# EAGLE design test2 (EAGLE 6.6.0)
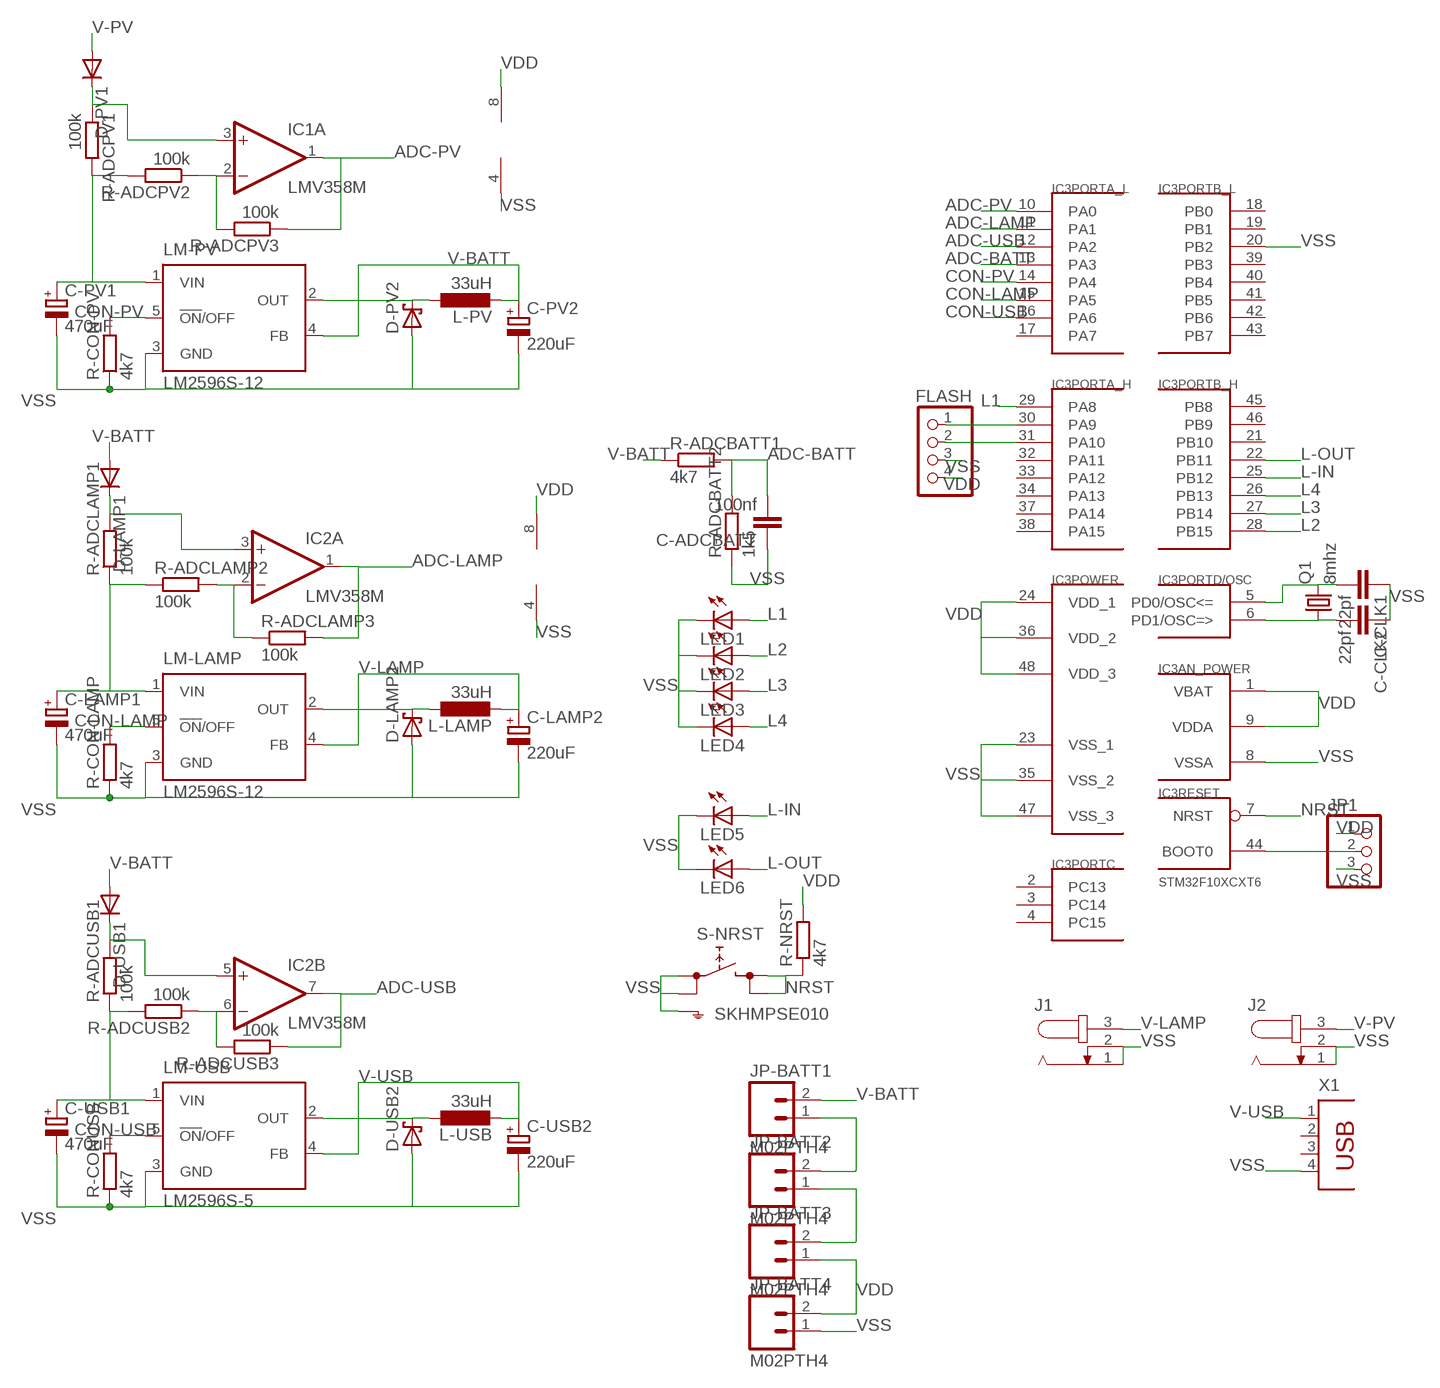
[diagram p0: schematic, sheet 1]

## Parts
C-ADCBATT  100nf  C-EUC0805  [C0805]
C-CLK1  22pf  C-EUC0805  [C0805]
C-CLK2  22pf  C-EUC0805  [C0805]
C-LAMP1  470uF  CPOL-EUE2.5-5  [E2,5-5]
C-LAMP2  220uF  CPOL-EUE2.5-5  [E2,5-5]
C-PV1  470uF  CPOL-EUE2.5-5  [E2,5-5]
C-PV2  220uF  CPOL-EUE2.5-5  [E2,5-5]
C-USB1  470uF  CPOL-EUE2.5-5  [E2,5-5]
C-USB2  220uF  CPOL-EUE2.5-5  [E2,5-5]
D-LAMP1  DIODE-DO-214AC  [DO-214AC]
D-LAMP2  SCHOTTKY-DIODE  [DIODE_SMB]
D-PV1  DIODE-DO-214AC  [DO-214AC]
D-PV2  SCHOTTKY-DIODE  [DIODE_SMB]
D-USB1  DIODE-DO-214AC  [DO-214AC]
D-USB2  SCHOTTKY-DIODE  [DIODE_SMB]
FLASH  PINHD-1X4  [1X04]
IC1  LMV358M  [SO08]
IC2  LMV358M  [SO08]
IC3  STM32F10XCXT6  [TQFP48]
J1  JACK-PLUG0  [SPC4077]
J2  JACK-PLUG0  [SPC4077]
JP1  PINHD-1X3  [1X03]
JP-BATT1  M02PTH4  [1X02_XTRA_BIG]
JP-BATT2  M02PTH4  [1X02_XTRA_BIG]
JP-BATT3  M02PTH4  [1X02_XTRA_BIG]
JP-BATT4  M02PTH4  [1X02_XTRA_BIG]
L-LAMP  33uH  L-EUWE-TPC  [POWER-CHOKE_WE-TPC]
L-PV  33uH  L-EUWE-TPC  [POWER-CHOKE_WE-TPC]
L-USB  33uH  L-EUWE-TPC  [POWER-CHOKE_WE-TPC]
LED1  LEDCHIP-LED0805  [CHIP-LED0805]
LED2  LEDCHIP-LED0805  [CHIP-LED0805]
LED3  LEDCHIP-LED0805  [CHIP-LED0805]
LED4  LEDCHIP-LED0805  [CHIP-LED0805]
LED5  LEDCHIP-LED0805  [CHIP-LED0805]
LED6  LEDCHIP-LED0805  [CHIP-LED0805]
LM-LAMP  LM2596S-12  LM2596S  [TO263-5]
LM-PV  LM2596S-12  LM2596S  [TO263-5]
LM-USB  LM2596S-5  LM2596S  [TO263-5]
Q1  8mhz  CRYSTALHC49S  [HC49/S]
R-ADCBATT1  4k7  R-EU_R0805  [R0805]
R-ADCBATT2  1k5  R-EU_R0805  [R0805]
R-ADCLAMP1  100k  R-EU_R0805  [R0805]
R-ADCLAMP2  100k  R-EU_R0805  [R0805]
R-ADCLAMP3  100k  R-EU_R0805  [R0805]
R-ADCPV1  100k  R-EU_R0805  [R0805]
R-ADCPV2  100k  R-EU_R0805  [R0805]
R-ADCPV3  100k  R-EU_R0805  [R0805]
R-ADCUSB1  100k  R-EU_R0805  [R0805]
R-ADCUSB2  100k  R-EU_R0805  [R0805]
R-ADCUSB3  100k  R-EU_R0805  [R0805]
R-CON-LAMP  4k7  R-EU_R0805  [R0805]
R-CON-PV  4k7  R-EU_R0805  [R0805]
R-CONUSB  4k7  R-EU_R0805  [R0805]
R-NRST  4k7  R-EU_R0805  [R0805]
S-NRST  SKHMPSE010  [SKHMPXE010]
X1  PN87520  [PN87520]

## Nets
ADC-BATT: C-ADCBATT.2 IC3.13(PORTA_L:PA3) R-ADCBATT1.2 R-ADCBATT2.2
ADC-LAMP: IC2.1(A:OUT) IC3.11(PORTA_L:PA1) R-ADCLAMP3.2
ADC-PV: IC1.1(A:OUT) IC3.10(PORTA_L:PA0) R-ADCPV3.1
ADC-USB: IC2.7(B:OUT) IC3.12(PORTA_L:PA2) R-ADCUSB3.1
CON-LAMP: IC3.15(PORTA_L:PA5) LM-LAMP.5(!ON!/OFF) R-CON-LAMP.2
CON-PV: IC3.14(PORTA_L:PA4) LM-PV.5(!ON!/OFF) R-CON-PV.2
CON-USB: IC3.16(PORTA_L:PA6) LM-USB.5(!ON!/OFF) R-CONUSB.2
L1: IC3.29(PORTA_H:PA8) LED1.A
L2: IC3.28(PORTB_H:PB15) LED2.A
L3: IC3.27(PORTB_H:PB14) LED3.A
L4: IC3.26(PORTB_H:PB13) LED4.A
L-IN: IC3.25(PORTB_H:PB12) LED5.A
L-OUT: IC3.22(PORTB_H:PB11) LED6.A
N$1: D-PV2.C(A) L-PV.1 LM-PV.2(OUT)
N$2: D-LAMP2.C(A) L-LAMP.1 LM-LAMP.2(OUT)
N$3: D-USB2.C(A) L-USB.1 LM-USB.2(OUT)
N$4: IC2.2(A:-IN) R-ADCLAMP2.2 R-ADCLAMP3.1
N$5: C-USB1.+ LM-USB.1(VIN) R-ADCUSB1.1 R-ADCUSB2.2
N$6: C-CLK2.2 IC3.6(PORTD/OSC:PD1/OSC=>) Q1.1
N$7: C-LAMP1.+ LM-LAMP.1(VIN) R-ADCLAMP1.1 R-ADCLAMP2.1
N$8: D-LAMP1.C IC2.3(A:+IN) R-ADCLAMP1.2
N$9: IC1.2(A:-IN) R-ADCPV2.1 R-ADCPV3.2
N$10: C-PV1.+ LM-PV.1(VIN) R-ADCPV1.2 R-ADCPV2.2
N$11: D-PV1.C IC1.3(A:+IN) R-ADCPV1.1
N$12: IC3.44(RESET:BOOT0) JP1.2
N$13: C-CLK1.2 IC3.5(PORTD/OSC:PD0/OSC<=) Q1.2
N$14: IC2.6(B:-IN) R-ADCUSB2.1 R-ADCUSB3.2
N$15: D-USB1.C IC2.5(B:+IN) R-ADCUSB1.2
N$16: FLASH.2 IC3.31(PORTA_H:PA10)
N$17: FLASH.1 IC3.30(PORTA_H:PA9)
N$20: JP-BATT2.1 JP-BATT3.2
N$21: JP-BATT1.1 JP-BATT2.2
NRST: IC3.7(RESET:NRST) R-NRST.1 S-NRST.3(2.1) S-NRST.4(2.2)
V-BATT: C-PV2.+ D-LAMP1.A D-USB1.A JP-BATT1.2 L-PV.2 LM-PV.4(FB) R-ADCBATT1.1
V-LAMP: C-LAMP2.+ J1.3 L-LAMP.2 LM-LAMP.4(FB)
V-PV: D-PV1.A J2.3
V-USB: C-USB2.+ L-USB.2 LM-USB.4(FB) X1.1
VDD: FLASH.4 IC1.8(P:V+) IC2.8(P:V+) IC3.1(AN_POWER:VBAT) IC3.9(AN_POWER:VDDA) IC3.24(POWER:VDD_1) IC3.36(POWER:VDD_2) IC3.48(POWER:VDD_3) JP1.1 JP-BATT3.1 JP-BATT4.2 R-NRST.2
VSS: C-ADCBATT.1 C-CLK1.1 C-CLK2.1 C-LAMP1.- C-LAMP2.- C-PV1.- C-PV2.- C-USB1.- C-USB2.- D-LAMP2.A(C) D-PV2.A(C) D-USB2.A(C) FLASH.3 IC1.4(P:V-) IC2.4(P:V-) IC3.8(AN_POWER:VSSA) IC3.20(PORTB_L:PB2) IC3.23(POWER:VSS_1) IC3.35(POWER:VSS_2) IC3.47(POWER:VSS_3) J1.1 J1.2 J2.1 J2.2 JP1.3 JP-BATT4.1 LED1.C LED2.C LED3.C LED4.C LED5.C LED6.C LM-LAMP.3(GND) LM-PV.3(GND) LM-USB.3(GND) R-ADCBATT2.1 R-CON-LAMP.1 R-CON-PV.1 R-CONUSB.1 S-NRST.1(1.1) S-NRST.2(1.2) S-NRST.5(SH) X1.4
Unconnected: IC1.5(B:+IN) IC1.6(B:-IN) IC1.7(B:OUT) IC3.2(PORTC:PC13) IC3.3(PORTC:PC14) IC3.4(PORTC:PC15) IC3.17(PORTA_L:PA7) IC3.18(PORTB_L:PB0) IC3.19(PORTB_L:PB1) IC3.21(PORTB_H:PB10) IC3.32(PORTA_H:PA11) IC3.33(PORTA_H:PA12) IC3.34(PORTA_H:PA13) IC3.37(PORTA_H:PA14) IC3.38(PORTA_H:PA15) IC3.39(PORTB_L:PB3) IC3.40(PORTB_L:PB4) IC3.41(PORTB_L:PB5) IC3.42(PORTB_L:PB6) IC3.43(PORTB_L:PB7) IC3.45(PORTB_H:PB8) IC3.46(PORTB_H:PB9) X1.2 X1.3

## Library data of the parts
C-ADCBATT C-CLK1 C-CLK2 = resistor:C-EU: CAPACITOR, European symbol
C-LAMP1 C-LAMP2 C-PV1 C-PV2 C-USB1 C-USB2 = resistor:CPOL-EU: POLARIZED CAPACITOR, European symbol
D-LAMP1 D-PV1 D-USB1 = diode:DIODE-: DIODE
D-LAMP2 D-PV2 D-USB2 = eagle-ltspice:SCHOTTKY-DIODE: Schottky Diode; SPICEMODEL: NONE; SPICEPREFIX: D; SPICETYPE: diode
FLASH = pinhead:PINHD-1X4: PIN HEADER
IC1 IC2 = linear:LMV358?*: Dual General Purpose, Low Voltage, Rail-to-Rail Output Operational Amplifiers Source: http://www.national.com/mpf/LM/LMV321.html http://www.national.com/dt/lmv_qual.pdf
IC3 = stm32:STM32F10XCXT6: ST STM32F101/103 48pin LQFP
J1 J2 = con-jack:JACK-PLUG: DC POWER JACK Power Jack, DC, Right Angle, Through Hole, Rated 5A at 16VDC, PC Terminals Distributor: Farnell (www.Farnell.de) Drawing: 84N1161.pdf / 84N1162.pdf Manufacturer: SPC Technology (www.spctechnology.com) Type: SPC4077 / SPC 4078; OC_FARNELL: unknown; OC_NEWARK: unknown
JP1 = pinhead:PINHD-1X3: PIN HEADER
JP-BATT1-JP-BATT4 = SparkFun-Connectors:M02: Standard 2-pin 0.1" header. Use with - straight break away headers ( PRT-00116) - right angle break away headers (PRT-00553) - swiss pins (PRT-00743) - machine pins (PRT-00117) - female headers (PRT-00115) Molex polarized connector foot print use with: PRT-08233 with associated crimp pins and housings. 2.54_SCREWTERM for use with PRT-10571. 3.5mm Screw Terminal footprints for PRT-08084 5mm Screw Terminal footprints for use with PRT-08432
L-LAMP L-PV L-USB = resistor:L-EU: INDUCTOR, European symbol
LED1-LED6 = led:LED: LED OSRAM: - CHIPLED LG R971, LG N971, LY N971, LG Q971, LY Q971, LO R971, LY R971 LH N974, LH R974 LS Q976, LO Q976, LY Q976 LO Q996 - Hyper CHIPLED LW Q18S LB Q993, LB Q99A, LB R99A - SideLED LS A670, LO A670, LY A670, LG A670, LP A670 LB A673, LV A673, LT A673, LW A673 LH A674 LY A675 LS A676, LA A676, LO A676, LY A676, LW A676 LS A679, LY A679, LG A679 - Hyper Micro SIDELED® LS Y876, LA Y876, LO Y876, LY Y876 LT Y87S - SmartLED LW L88C, LW L88S LB L89C, LB L89S, LG L890 LS L89K, LO L89K, LY L89K LS L896, LA L896, LO L896, LY L896 - TOPLED LS T670, LO T670, LY T670, LG T670, LP T670 LSG T670, LSP T670, LSY T670, LOP T670, LYG T670 LG T671, LOG T671, LSG T671 LB T673, LV T673, LT T673, LW T673 LH T674 LS T676, LA T676, LO T676, LY T676, LB T676, LH T676, LSB T676, LW T676 LB T67C, LV T67C, LT T67C, LS T67K, LO T67K, LY T67K, LW E67C LS E67B, LA E67B, LO E67B, LY E67B, LB E67C, LV E67C, LT E67C LW T67C LS T679, LY T679, LG T679 LS T770, LO T770, LY T770, LG T770, LP T770 LB T773, LV T773, LT T773, LW T773 LH T774 LS E675, LA E675, LY E675, LS T675 LS T776, LA T776, LO T776, LY T776, LB T776 LHGB T686 LT T68C, LB T68C - Hyper Mini TOPLED® LB M676 - Mini TOPLED Santana® LG M470 LS M47K, LO M47K, LY M47K Source: http://www.osram.convergy.de LUXEON: - LUMILED® LXK2-PW12-R00, LXK2-PW12-S00, LXK2-PW14-U00, LXK2-PW14-V00 LXK2-PM12-R00, LXK2-PM12-S00, LXK2-PM14-U00 LXK2-PE12-Q00, LXK2-PE12-R00, LXK2-PE12-S00, LXK2-PE14-T00, LXK2-PE14-U00 LXK2-PB12-K00, LXK2-PB12-L00, LXK2-PB12-M00, LXK2-PB14-N00, LXK2-PB14-P00, LXK2-PB14-Q00 LXK2-PR12-L00, LXK2-PR12-M00, LXK2-PR14-Q00, LXK2-PR14-R00 LXK2-PD12-Q00, LXK2-PD12-R00, LXK2-PD12-S00 LXK2-PH12-R00, LXK2-PH12-S00 LXK2-PL12-P00, LXK2-PL12-Q00, LXK2-PL12-R00 Source: www.luxeon.com KINGBRIGHT: KA-3528ASYC Source: www.kingbright.com
LM-LAMP LM-PV LM-USB = national-semiconductor:LM2596: SIMPLE SWITCHER® Power Converter 150 kHz 3A Step-Down Voltage Regulator Source: http://www.national.com/ds/LM/LM2596.pdf; MF: NATIONAL SEMICONDUCTOR; MPN: LM2596S-ADJ/NOPB; OC_FARNELL: 9494367; OC_NEWARK: 41K3842
Q1 = crystal:CRYSTAL: CRYSTAL; OC_FARNELL: 1667008; OC_NEWARK: unknown
R-ADCBATT1 R-ADCBATT2 R-ADCLAMP1-R-ADCLAMP3 R-ADCPV1-R-ADCPV3 R-ADCUSB1-R-ADCUSB3 R-CON-LAMP R-CON-PV R-CONUSB R-NRST = resistor:R-EU_: RESISTOR, European symbol
S-NRST = switch:SKHMP*E010: 6.2 X 6.5mm TACT Switch (SMD) Source: http://www3.alps.co.jp/WebObjects/catalog.woa/PDF/E/Switch/Tact/SKHM/SKHM.PDF
X1 = con-berg:PN87520: BERG USB connector; OC_FARNELL: unknown; OC_NEWARK: unknown

## Board
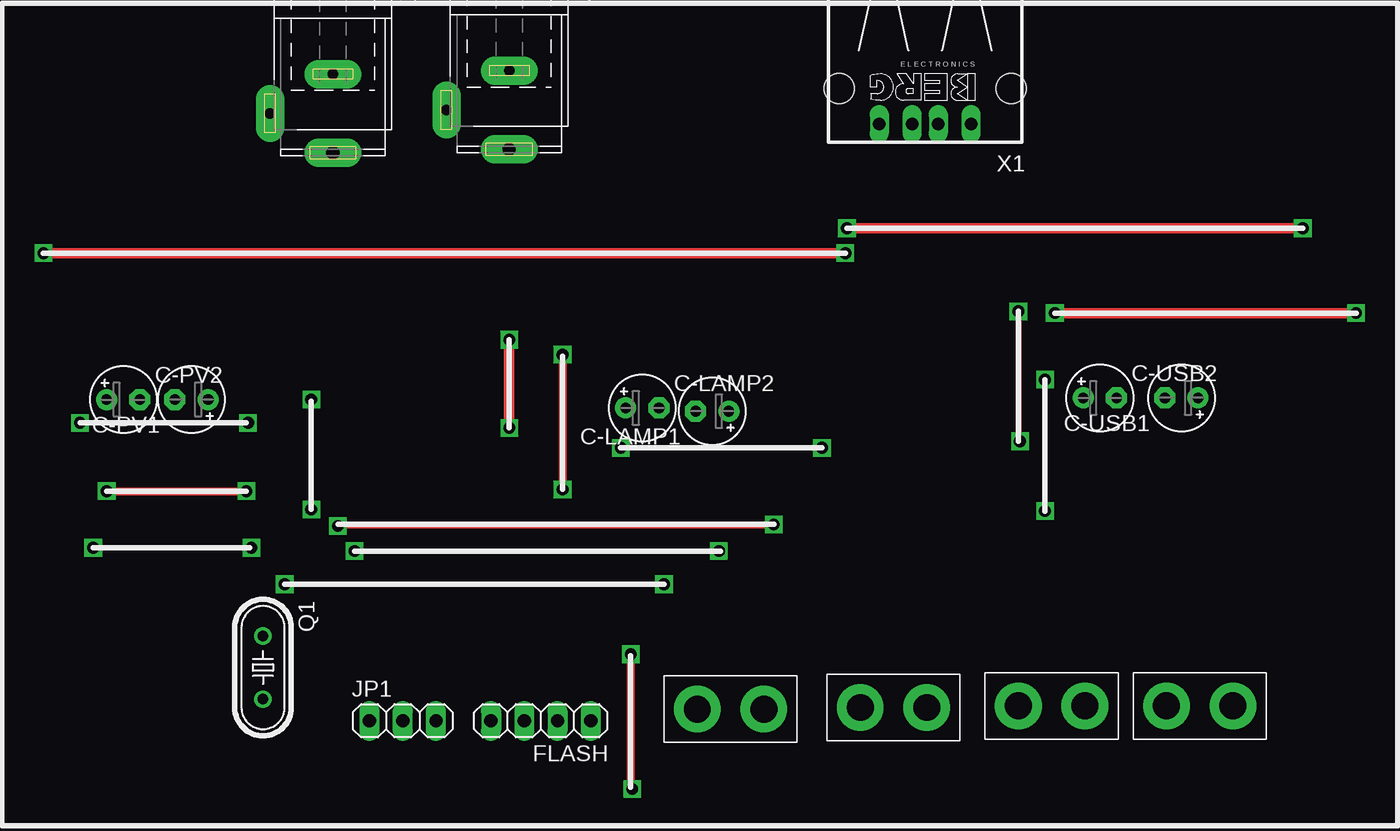
[diagram p1: board, top side]
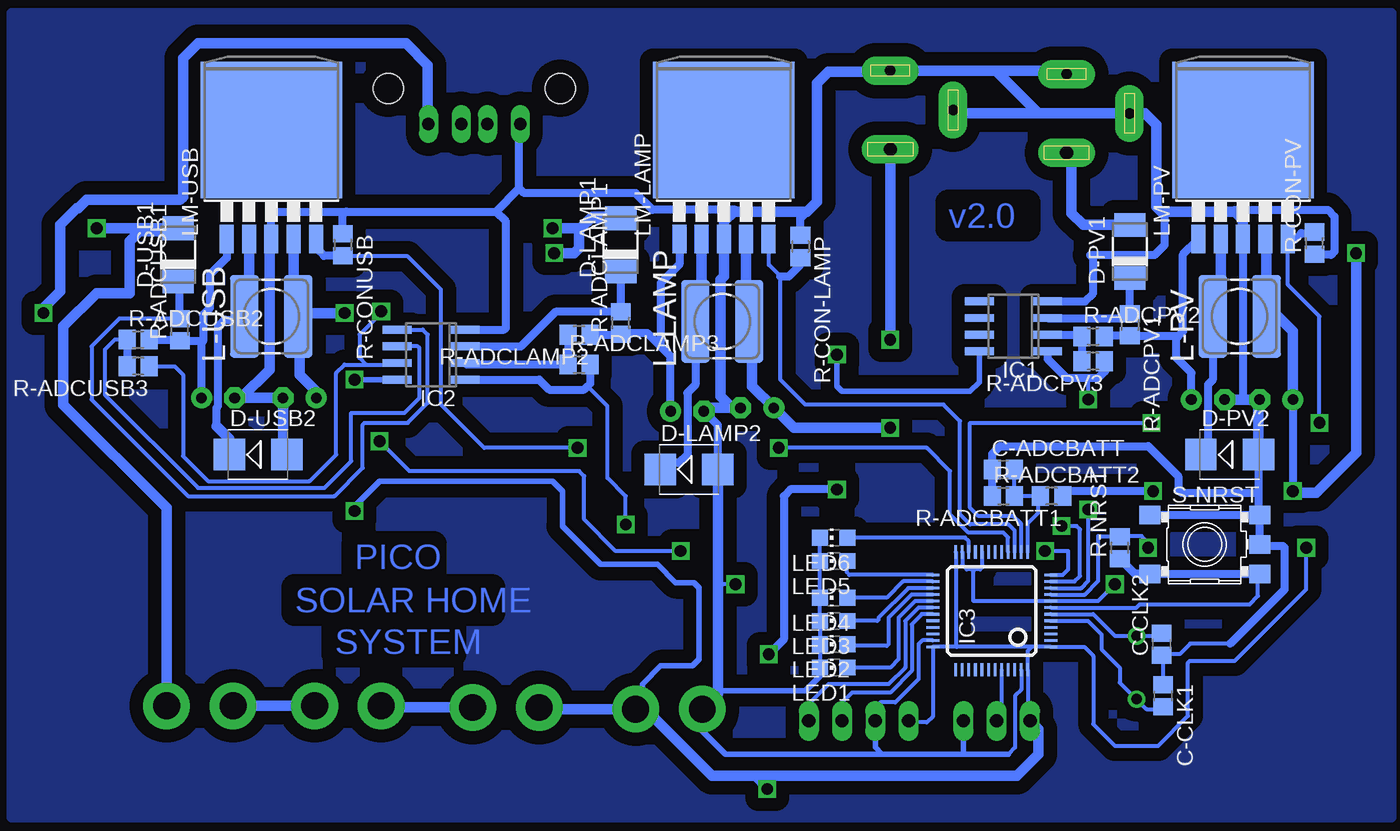
[diagram p2: board, bottom side, seen from below]

No outline drawn. Coordinates in mm, seen from the top.
Copper layers (1*16): Top 0.035mm / dielectric 1.5mm / Bottom 0.035mm
Design rules "default": minimum track width 10mil, minimum drill 24mil, track to track 8mil, track to pad 8mil, pad to pad 8mil, via to via 8mil, smd to smd 8mil, copper to edge 40mil, drill to drill 8mil, minimum pad ring 10mil, minimum via ring 8mil, stop-mask expansion 4mil, vias tented up to drill 0mil, thermal gap 10mil

### Footprints (pad centres in the part's own frame; a part is rotated, then mirrored left to right if it is on the bottom)
C0805 = smd 1.3 x 1.5: 1 -0.85,0; 2 0.85,0
E2,5-5 = drill 0.813 pad 1.6: + -1.27,0 | drill 0.813 pad 1.6 octagon: - 1.27,0
DO-214AC = smd 1.8 x 2.4: A 2.025,0; C -2.025,0
DIODE_SMB = smd 2.4 x 2.4: A 2.2,0; C -2.2,0
1X04 = drill 1.016 long: 1 -3.81,0; 2 -1.27,0; 3 1.27,0; 4 3.81,0
SO08 = smd 0.6 x 2.2: 1 -1.905,-2.6; 2 -0.635,-2.6; 3 0.635,-2.6; 4 1.905,-2.6; 5 1.905,2.6; 6 0.635,2.6; 7 -0.635,2.6; 8 -1.905,2.6
TQFP48 = smd 0.2 x 1: 1 -2.75,-4.5; 2 -2.25,-4.5; 3 -1.75,-4.5; 4 -1.25,-4.5; 5 -0.75,-4.5; 6 -0.25,-4.5; 7 0.25,-4.5; 8 0.75,-4.5; 9 1.25,-4.5; 10 1.75,-4.5; 11 2.25,-4.5; 12 2.75,-4.5; 25 2.75,4.5; 26 2.25,4.5; 27 1.75,4.5; 28 1.25,4.5; 29 0.75,4.5; 30 0.25,4.5; 31 -0.25,4.5; 32 -0.75,4.5; 33 -1.25,4.5; 34 -1.75,4.5; 35 -2.25,4.5; 36 -2.75,4.5 | smd 1 x 0.2: 13 4.5,-2.75; 14 4.5,-2.25; 15 4.5,-1.75; 16 4.5,-1.25; 17 4.5,-0.75; 18 4.5,-0.25; 19 4.5,0.25; 20 4.5,0.75; 21 4.5,1.25; 22 4.5,1.75; 23 4.5,2.25; 24 4.5,2.75; 37 -4.5,2.75; 38 -4.5,2.25; 39 -4.5,1.75; 40 -4.5,1.25; 41 -4.5,0.75; 42 -4.5,0.25; 43 -4.5,-0.25; 44 -4.5,-0.75; 45 -4.5,-1.25; 46 -4.5,-1.75; 47 -4.5,-2.25; 48 -4.5,-2.75
SPC4077 = drill 0.8 pad 2.184 long: 1 -3,0; 2 0,-4.8 | drill 1 pad 2.184 long: 3 3,0
1X03 = drill 1.016 long: 1 -2.54,0; 2 0,0; 3 2.54,0
1X02_XTRA_BIG = drill 2.057 pad 3.556: 1 -2.54,0; 2 2.54,0
POWER-CHOKE_WE-TPC = smd 6.3 x 2.2: 1 0,2.05; 2 0,-2.05
CHIP-LED0805 = smd 1.2 x 1.2: A 0,-1.05; C 0,1.05
TO263-5 = smd 1.067 x 2.159: 1 -3.404,-5.791; 2 -1.702,-5.791; 3 0,-5.791; 4 1.702,-5.791; 5 3.404,-5.791 | smd 10.8 x 10.41: 6 0,2.54
HC49/S = drill 0.813: 1 -2.413,0; 2 2.413,0
R0805 = smd 1.3 x 1.5: 1 -0.85,0; 2 0.85,0
SKHMPXE010 = smd 1.6 x 1.4: 1 -4.2,2.25; 2 4.2,2.25; 3 -4.2,-2.25; 4 4.2,-2.25; 5 4.2,0
PN87520 = drill 0.95 long: 1 -3.5,2.71; 2 -1,2.71; 3 1,2.71; 4 3.5,2.71 | hole 2.3: -6.57,0; 6.57,0

### Placement (x,y rotation side)
C-ADCBATT  26.67,29.46 0 bottom
C-CLK1  14.48,12.19 270 bottom
C-CLK2  14.61,16.13 90 bottom
C-LAMP1  50.8,33.91 180 top
C-LAMP2  45.47,34.16 0 top
C-PV1  11.05,34.8 180 top
C-PV2  5.84,34.8 0 top
C-USB1  86.61,34.92 180 top
C-USB2  80.39,34.92 0 top
D-LAMP1  55.88,46.61 90 bottom
D-LAMP2  50.67,29.46 0 bottom
D-PV1  17.02,46.1 90 bottom
D-PV2  9.4,30.61 0 bottom
D-USB1  89.66,45.85 90 bottom
D-USB2  83.57,30.61 0 bottom
FLASH  37.72,10.29 180 top
IC1  25.91,40.39 90 bottom
IC2  70.36,38.23 90 bottom
IC3  27.56,18.67 90 bottom
J1  35.31,56.9 270 top
J2  21.84,56.64 270 top
JP1  27.18,10.29 0 top
JP-BATT1  88.01,11.43 0 top
JP-BATT2  76.71,11.43 0 top
JP-BATT3  64.64,11.3 0 top
JP-BATT4  52.2,11.18 0 top
L-LAMP  48.13,40.77 90 bottom
L-PV  8.64,41.15 90 bottom
L-USB  82.55,41.15 90 bottom
LED1  39.62,14.35 90 bottom
LED2  39.62,16.13 90 bottom
LED3  39.62,17.91 90 bottom
LED4  39.62,19.68 90 bottom
LED5  39.62,22.48 90 bottom
LED6  39.62,24.26 90 bottom
LM-LAMP  48.01,52.83 0 bottom
LM-PV  8.38,52.83 0 bottom
LM-USB  82.55,52.83 0 bottom
Q1  16.51,14.35 270 top
R-ADCBATT1  22.99,27.43 180 bottom
R-ADCBATT2  26.67,27.43 0 bottom
R-ADCLAMP1  55.88,40.64 90 bottom
R-ADCLAMP2  59.05,39.75 180 bottom
R-ADCLAMP3  59.05,37.47 0 bottom
R-ADCPV1  17.02,40.51 270 bottom
R-ADCPV2  19.81,39.62 0 bottom
R-ADCPV3  19.81,37.72 180 bottom
R-ADCUSB1  89.53,40.13 90 bottom
R-ADCUSB2  92.71,39.37 0 bottom
R-ADCUSB3  92.71,37.34 180 bottom
R-CON-LAMP  42.16,46.48 270 bottom
R-CON-PV  2.92,46.74 90 bottom
R-CONUSB  77.09,46.61 270 bottom
R-NRST  17.78,23.5 90 bottom
S-NRST  11.3,23.75 0 bottom
X1  67.06,58.55 180 top

### Tracks (layer width: path | path; a pad name or v marks a point on that pad's centre or on a via)
ADC-BATT
  Bottom 0.305: IC3.13 24.81,25.36 24,26.16 24,27.27 R-ADCBATT1.2 R-ADCBATT2.2 C-ADCBATT.2
ADC-LAMP  (via drill 0.9)
  Top 0.305: v22.23,25.15 55.37,25.15 v55.5,25.27
  Bottom 0.305: IC3.11 21.25,20.92 20.83,21.34 20.83,24.89 21.08,25.15 v22.23,25.15 | v55.5,25.27 55.5,27.43 56.9,28.83 56.9,34.29 58.42,35.81
  Bottom 0.61: IC2.1 62.1,36.32 61.34,35.56 58.67,35.56 58.42,35.81 58.2,36.03 R-ADCLAMP3.2
ADC-PV  (via drill 0.9)
  Top 0.305: v20.19,26.42 v20.19,34.8
  Bottom 0.305: IC3.10 20.73,20.42 20.19,20.95 v20.19,26.42 | v20.19,34.8 20.19,36.32 20.32,36.45
  Bottom 0.61: IC1.1 23.31,37.91 21.84,36.45 20.32,36.45 19.43,36.45 18.92,36.96 18.92,37.68 R-ADCPV3.1
ADC-USB  (via drill 0.9)
  Top 0.305: v23.5,23.24 v51.31,23.24 | v74.3,31.62 74.3,41.4 v74.17,41.53
  Bottom 0.305: R-ADCUSB3.1 89.92,37.34 89.28,36.7 89.28,30.48 87.38,28.57 79.63,28.57 77.6,30.61 77.6,36.83 76.96,37.47 75.31,37.47 | 75.31,37.47 73.08,37.47 IC2.7 | IC3.12 22.14,21.42 21.72,21.84 21.72,23.24 v23.5,23.24 | v51.31,23.24 56.26,23.24 58.67,25.65 58.67,28.96 59.05,29.34 72.01,29.34 v74.3,31.62 | v74.17,41.53 74.17,41.4 75.82,39.75 75.82,37.97 75.31,37.47
CON-LAMP
  Bottom 0.305: IC3.15 25.81,24.79 26.29,25.27 29.21,25.27 29.97,26.04 29.97,33.15 31.24,34.42 41.78,34.42 43.69,36.32 43.69,44.2 44.58,45.09 44.58,47.02 LM-LAMP.5
  Bottom 0.61: 43.69,44.2 43.05,44.2 42.16,45.09 R-CON-LAMP.2
CON-PV  (via drill 0.9)
  Top 0.305: v15.37,33.02 v2.54,33.02
  Bottom 0.305: IC3.14 25.31,25.31 25.91,25.91 28.57,25.91 29.21,26.54 29.21,33.02 v15.37,33.02 | v2.54,33.02 2.54,41.15 4.95,43.56 4.95,47.02 LM-PV.5
  Bottom 0.61: 4.95,47.02 4.42,47.02 3.94,47.5 3.01,47.5 R-CON-PV.2
CON-USB  (via drill 0.9)
  Top 0.305: v43.81,31.11 v59.18,31.11
  Bottom 0.305: IC3.16 26.31,24.28 26.67,24.64 29.34,24.64 30.73,26.04 30.73,29.34 32.51,31.11 v43.81,31.11 | v59.18,31.11 66.29,31.11 69.6,34.42 69.6,43.18 72.14,45.72 77.05,45.72 R-CONUSB.2
  Bottom 0.61: R-CONUSB.2 78.53,45.76 79.12,46.35 79.12,47.02 LM-USB.5
L1
  Bottom 0.305: IC3.29 33.41,19.42 34.67,18.16 34.67,14.99 35.31,14.35 LED1.A
L2
  Bottom 0.305: IC3.28 33.67,19.92 35.43,18.16 35.43,16.13 35.56,16 38.45,16 LED2.A
L3
  Bottom 0.305: IC3.27 33.94,20.42 36.2,18.16 36.2,18.03 36.32,17.91 LED3.A
L4
  Bottom 0.305: IC3.26 34.33,20.92 35.56,19.68 LED4.A
L-IN
  Bottom 0.305: IC3.25 38.44,21.42 38.61,21.59 38.61,22.45 LED5.A
L-OUT
  Bottom 0.305: IC3.22 29.31,23.98 29.59,24.26 LED6.A
N$1
  Bottom 0.61: L-PV.1 10.69,36.3 11.05,35.94 11.05,31.16 D-PV2.C
  Bottom 0.813: LM-PV.2 10.08,41.75 L-PV.1
N$2
  Bottom 0.61: L-LAMP.1 50.18,35.92 50.8,35.31 50.8,30.61 51.44,29.97 52.37,29.97 D-LAMP2.C
  Bottom 0.813: LM-LAMP.2 49.71,41.24 L-LAMP.1
N$3
  Bottom 0.61: 86.74,32.77 86.74,34.16 86.61,34.29 86.61,40.39 86.11,40.89 85.09,40.89 84.84,40.64 | L-USB.1 84.58,41.15 84.45,41.02
  Bottom 0.813: LM-USB.2 84.25,41.22 84.45,41.02 84.84,40.64 | D-USB2.C 85.77,31.79 86.74,32.77
N$4
  Bottom 0.61: R-ADCLAMP2.2 R-ADCLAMP3.1 67.63,37.47 IC2.2
N$5
  Bottom 0.61: LM-USB.1 85.95,45.62 87.25,44.32 87.25,41.78 87.76,41.27 87.76,39.24 87.88,39.24 | 87.88,39.24 89.5,39.24 R-ADCUSB1.1 89.62,39.37 R-ADCUSB2.2 | C-USB1.+ 87.88,39.24
N$6
  Bottom 0.305: IC3.6 19.82,18.42 18.16,16.76 Q1.1 14.82,16.76 C-CLK2.2
N$7
  Bottom 0.61: C-LAMP1.+ 52.07,38.1 52.83,38.86 | 52.83,38.86 53.85,39.88 55.79,39.88 R-ADCLAMP1.1 55.92,39.75 R-ADCLAMP2.1 | LM-LAMP.1 51.41,45.11 52.83,43.69 52.83,38.86
N$8
  Bottom 0.61: D-LAMP1.C R-ADCLAMP1.2 60.87,41.49 63.5,38.86 IC2.3
N$9
  Bottom 0.61: R-ADCPV3.2 R-ADCPV2.1 20.79,39.75 IC1.2
N$10
  Bottom 0.61: 13.3,39.66 R-ADCPV1.2 18.92,39.66 R-ADCPV2.2 | 13.3,39.66 12.95,40.01 12.95,45.87 LM-PV.1 | C-PV1.+ 12.32,36.83 13.46,37.97 13.46,39.5 13.3,39.66
N$11
  Bottom 0.61: D-PV1.C R-ADCPV1.1 17.36,41.02 IC1.3
N$12
  Bottom 0.305: IC3.44 26.81,10.66 JP1.2
N$13
  Bottom 0.305: IC3.5 20.2,17.92 19.18,16.89 19.18,15.75 17.78,14.35 17.78,13.21 Q1.2 15.75,11.18 14.64,11.18 C-CLK1.2
N$14
  Bottom 0.305: R-ADCUSB2.1 94.49,39.37 95.25,38.61 95.25,35.18 88.14,28.07 78.49,28.07 76.45,30.1 76.45,33.78 72.39,33.78 71.25,34.92 71.25,38.73 71.37,38.86 IC2.6
  Bottom 0.61: R-ADCUSB2.1 R-ADCUSB3.2
N$15
  Bottom 0.305: R-ADCUSB1.2 94.15,40.98 96.27,38.86 96.27,34.8 88.9,27.43 77.72,27.43 75.56,29.59 75.56,32.89 75.44,33.02 72.14,33.02 70.61,34.54 70.61,39.75 70.99,40.13 IC2.5
  Bottom 0.61: R-ADCUSB1.2 89.53,43.7 D-USB1.C
N$16
  Bottom 0.305: IC3.31 32.89,18.42 33.66,17.65 33.66,14.1 35.31,12.45 38.23,12.45 38.99,11.68 FLASH.2
N$17
  Bottom 0.305: IC3.30 33.15,18.92 34.16,17.91 34.16,14.35 35.43,13.08 40.01,13.08 41.4,11.68 41.4,10.41 FLASH.1
N$18
  pour Bottom (isolate 1.016): -2.92,64.26 102.36,64.26 102.36,2.92 -2.92,2.92
N$20
  Bottom 0.813: JP-BATT3.2 74.04,11.3 JP-BATT2.1
N$21
  Bottom 0.813: JP-BATT2.2 JP-BATT1.1
NRST
  Bottom 0.305: IC3.7 16.51,18.92 16.26,19.18 7.87,19.18 7.24,19.81 7.24,21.36 S-NRST.4 | 15.62,21.38 S-NRST.3
  Bottom 0.61: S-NRST.4 S-NRST.3 16.63,21.5 R-NRST.1
V-BATT  (via drill 0.9)
  Top 0.61: v4.57,27.81 v15.24,27.81
  Top 0.813: v95.89,47.88 v61.09,47.88 | v60.96,45.97 v-0.25,45.97
  Bottom 0.61: C-PV2.+ v4.57,27.81 | v15.24,27.81 21.76,27.81 R-ADCBATT1.1
  Bottom 0.813: LM-PV.4 6.59,47.04 L-PV.2 5.71,41.15 4.57,40.01 C-PV2.+ | JP-BATT1.2 90.55,26.54 98.42,34.42 98.42,40.39 95.89,42.93 93.34,42.93 93.34,46.86 92.58,47.62 89.91,47.62 D-USB1.A 95.88,47.87 v95.89,47.88 | v61.09,47.88 58.93,47.88 58.04,48.77 56.01,48.77 D-LAMP1.A 58.17,48.63 59.05,47.75 59.05,46.35 59.44,45.97 v60.96,45.97 | v-0.25,45.97 -0.25,30.73 2.79,27.69 4.45,27.69 v4.57,27.81
V-LAMP  (via drill 0.9)
  Top 0.813: v35.31,39.37 v35.31,32.64
  Bottom 0.813: LM-LAMP.4 46.3,40.99 L-LAMP.2 46.23,40.91 46.23,41.4 45.85,41.02 45.85,35.81 C-LAMP2.+ 42.67,32.64 v35.31,32.64 | J1.3 v35.31,39.37
V-PV
  Bottom 0.813: D-PV1.A 20.57,48.13 21.46,49.02 21.46,53.26 J2.3
V-USB  (via drill 0.9)
  Top 0.813: v76.96,41.4 v99.95,41.4
  Bottom 0.406: LM-USB.4 80.85,41.99 80.26,41.4
  Bottom 0.813: LM-USB.4 80.85,41.5 L-USB.2 80.39,41.04 80.39,36.7 79.12,35.43 C-USB2.+ | 80.26,41.4 v76.96,41.4 | v99.95,41.4 99.95,41.78 98.68,43.05 98.68,48.13 97.41,49.4 97.28,49.4 96.65,50.04 89.53,50.04 89.28,50.29 89.28,60.83 88.14,61.98 72.26,61.98 70.61,60.33 70.61,55.89 X1.1
VDD  (via drill 0.9)
  Top 0.305: v3.56,23.5 v15.62,23.5
  Top 0.406: v76.2,36.32 v76.2,26.29
  Top 0.61: v39.37,38.23 v39.37,27.94 | v44.58,15.37 44.58,5.21 v44.7,5.08
  Bottom 0.305: JP1.1 24.81,10.46 IC3.48 24.81,15.62 24.51,15.92 | 24.51,15.92 IC3.1 20.49,15.92 19.81,15.24 19.81,10.03 18.16,8.38 14.86,8.38 12.57,10.67 12.57,14.73 12.45,14.86 9.02,14.86 3.56,20.32 v3.56,23.5 | 24.51,15.92 30.23,15.92 | 30.23,15.92 IC3.36 32.06,10.61 32.51,10.16 33.78,10.16 FLASH.4 | IC3.24 30.31,16 30.23,15.92 | IC3.9 20.47,19.92 19.43,20.95 19.43,24.38 17.82,24.38 R-NRST.2 17.74,24.38 16.13,24.38 15.62,23.88 v15.62,23.5
  Bottom 0.406: IC2.8 v76.2,36.32 | v76.2,26.29 76.2,26.67 74.3,28.57 61.09,28.57 60.33,27.81 60.33,25.15 57.4,22.23 53.09,22.23 51.69,20.83 50.29,20.83 49.91,20.45 49.91,14.99 50.42,14.48 52.83,14.48 54.23,13.08 54.23,11.3 54.1,11.18 | IC1.8 28.51,36.13 29.21,35.43 38.99,35.43 39.37,35.81 v39.37,38.23
  Bottom 0.61: v39.37,27.94 42.93,27.94 43.43,27.43 43.43,16.51 v44.58,15.37 | v44.7,5.08 45.72,6.1
  Bottom 0.813: JP-BATT3.1 61.98,11.18 JP-BATT4.2 54.1,11.18 53.98,11.18 48.9,6.1 45.72,6.1 25.65,6.1 24,7.75 24,9.65 JP1.1
VSS  (via drill 0.9)
  Top 0.305: v18.16,20.7 v47.12,20.7
  Bottom 0.305: IC3.23 29.81,22.19 29.46,21.84 29.08,21.84 | IC3.20 28.31,21.98 28.45,21.84 29.08,21.84 | LED1.C LED2.C LED3.C LED4.C LED5.C LED6.C | IC3.47 25.31,12.66 25.78,12.19 25.78,8.26 26.29,7.75 | C-ADCBATT.1 R-ADCBATT2.1 | IC3.8 28.94,19.42 28.96,19.43 | 28.96,19.43 28.96,21.72 29.08,21.84 | IC3.35 32.86,16.42 33.15,16.13 33.15,13.46 34.92,11.68 36.07,11.68 36.45,11.3 FLASH.3 | 28.96,19.43 19.43,19.43 v18.16,20.7 | v47.12,20.7 48.09,20.7 48.47,20.32 | C-CLK1.1 14.48,15.15 C-CLK2.1 14.52,15.37 13.21,15.37 12.41,16.17 9.36,16.17
  Bottom 0.406: 26.29,7.75 29.59,7.75 | 29.59,7.75 35.94,7.75 | JP1.3 29.72,7.87 29.59,7.75 | LED1.C 40.67,13.68 41.78,12.57 48.26,12.57 49.28,11.56 JP-BATT4.1 49.66,9.53 47.88,7.75 35.94,7.75 | FLASH.3 36.45,8.26 35.94,7.75
  Bottom 0.61: 8.26,34.8 8.38,34.92 LM-PV.3 8.38,48.64 9.02,49.28 1.91,49.28 1.4,48.77 1.4,46.1 1.65,45.85 2.88,45.85 R-CON-PV.1 | D-LAMP2.A 48.47,32.85 C-LAMP1.- | D-PV2.A 7.2,27.81 | 7.2,27.81 7.2,26.09 S-NRST.2 | S-NRST.1 S-NRST.2 | S-NRST.2 S-NRST.5 6.98,23.62 5.33,23.62 5.21,23.5 5.21,20.32 9.36,16.17 | IC1.4 20.45,42.29 19.81,42.93 19.81,45.59 20.07,45.85 15.11,45.85 14.35,46.61 14.35,48.9 14.61,49.15 | R-CON-LAMP.1 42.16,48.64 41.15,49.66 | LM-USB.3 82.55,48.77 82.17,49.15 76.83,49.15 | 76.83,49.15 65.41,49.15 | 65.41,49.15 63.63,50.93 | 63.63,50.93 63.63,55.77 X1.4 | 48.01,48.39 47.12,49.28 53.47,49.28 54.74,50.55 63.25,50.55 63.63,50.93 | R-CONUSB.1 77.09,48.9 76.83,49.15 | IC2.4 64.77,40.13 64.64,40.26 64.64,48.39 65.41,49.15 | R-ADCBATT2.1 27.52,30.65 26.92,31.24 15.62,31.24 13.34,28.96 13.34,27.94 13.08,27.69 7.33,27.69 7.2,27.81
  Bottom 0.813: C-PV1.- 8.26,34.8 C-PV2.- 7.2,34.71 D-PV2.A | 24,56.64 J2.2 15.88,56.64 14.99,55.75 14.99,49.53 14.61,49.15 9.02,49.15 8.38,48.51 LM-PV.3 | 24,56.64 30.25,56.64 J1.2 | J1.1 22.1,59.9 J2.1 | J1.1 27.26,59.9 24,56.64 | J1.1 35.38,59.82 40.01,59.82 40.89,58.93 40.89,49.91 41.15,49.66 41.66,49.15 47.24,49.15 48.01,48.39 LM-LAMP.3 48.01,44.2 48.26,43.94 48.26,35.05 47.37,34.16 C-LAMP2.- 49.28,34.16 C-LAMP1.- | LM-USB.3 82.68,46.91 82.68,37.08 84.84,34.92 C-USB1.- C-USB2.- 81.66,30.9 D-USB2.A | D-LAMP2.A 48.47,20.32 48.47,12.36 49.28,11.56

### Text on the board
Bottom: v2.0 | PICO | SOLAR HOME | SYSTEM